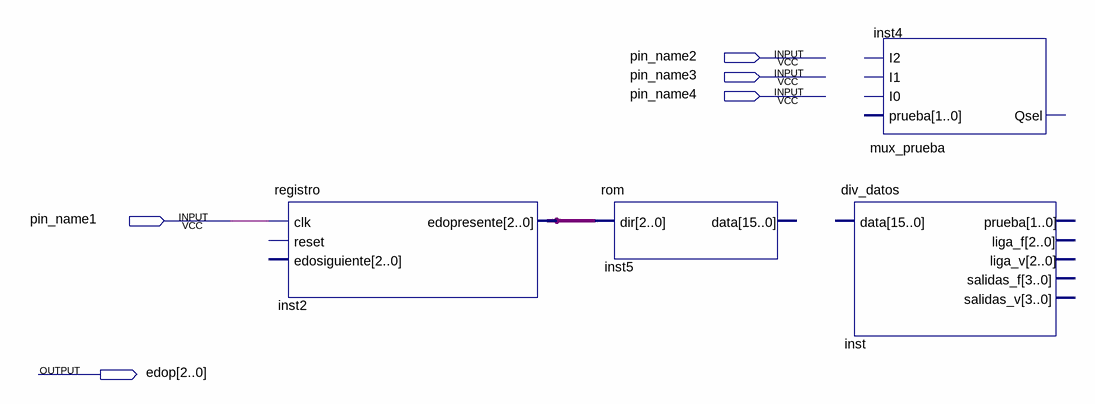
[diagram p0: schematic sheet]
// Quartus schematic practica4_EMV_POA.bdf as structural Verilog: 4 symbols, 5 pins
module practica4_EMV_POA (
  input  pin_name2,
  input  pin_name3,
  input  pin_name4,
  input  pin_name1,
  output [2:0] edop
);

  wire [2:0] inst2_edopresente;

  registro inst2 (.clk(pin_name1), .edopresente(inst2_edopresente));  // open: reset, edosiguiente
  rom inst5 (.dir(inst2_edopresente));  // open: data
  div_datos inst ();  // open: data, prueba, liga_f, liga_v, salidas_f, salidas_v
  mux_prueba inst4 ();  // open: prueba, I0, I1, I2, Qsel
endmodule
